# Altium schematic sheet hv_io_DCDC.SchDoc
size A4; Organization: Badgerloop; Address1: 133 Engineering Research; Address2: Building; Address3: Madison, WI 53715
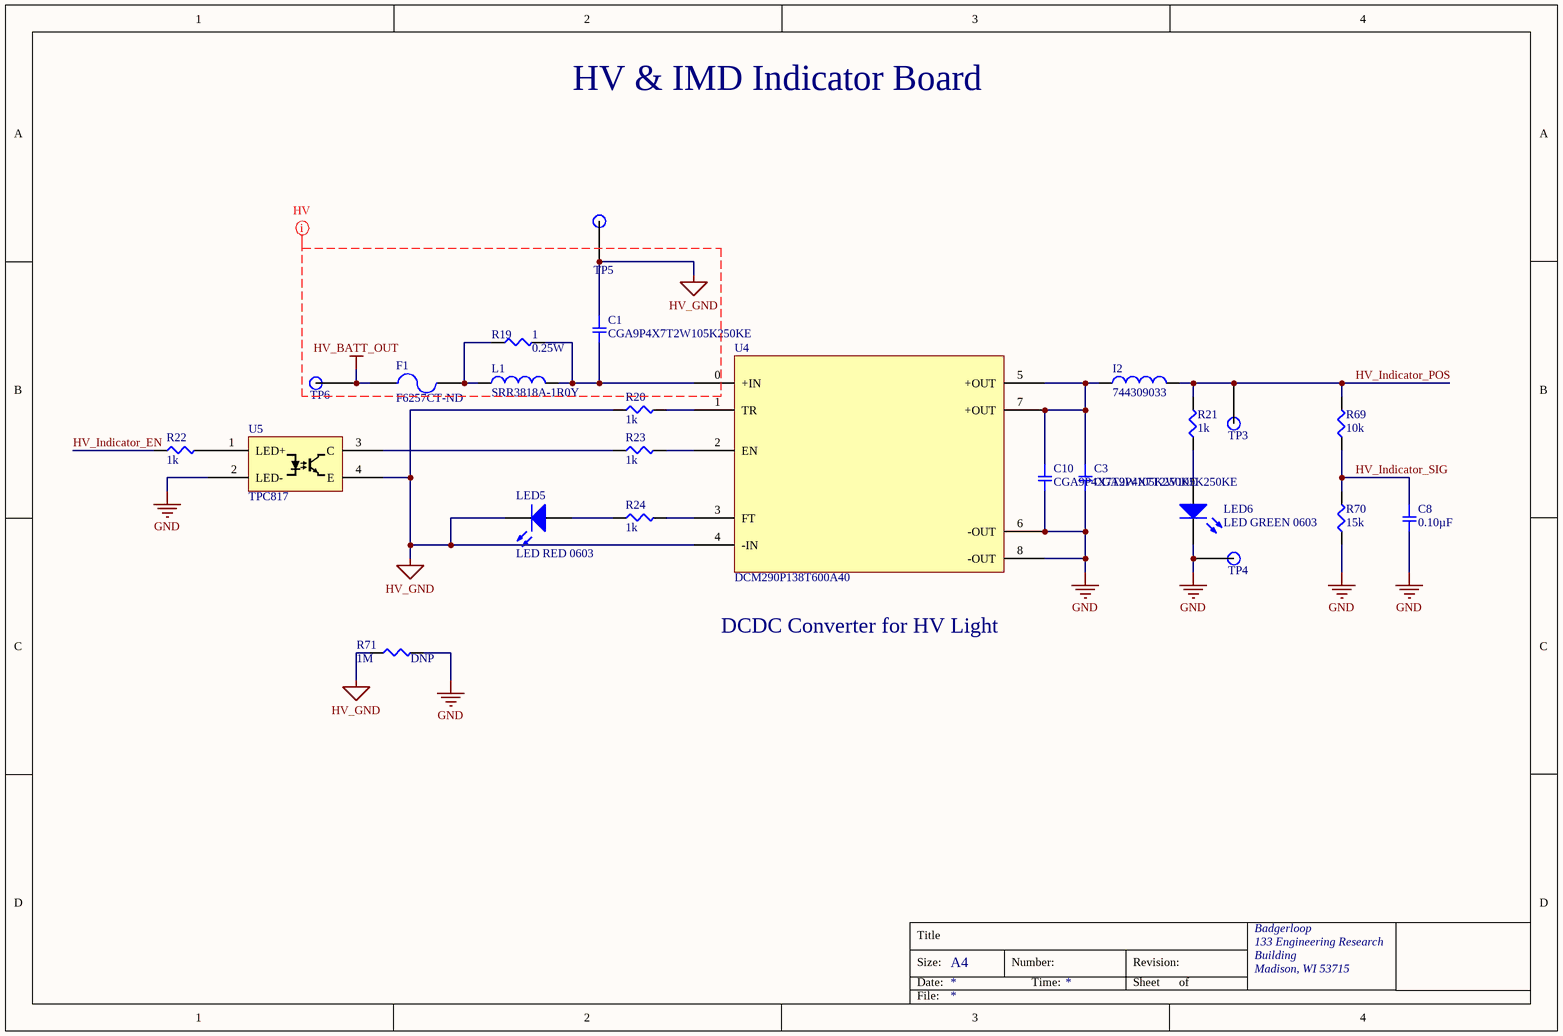
[diagram p0: hv_io_DCDC.SchDoc]

## Parts
C1  CGA9P4X7T2W105K250KE  [CAPC8350X15N]
C3  CGA9P4X7T2W105K250KE  [CAPC8350X15N]
C8  0.10µF  [SMD-0805C]
C10  CGA9P4X7T2W105K250KE  [CAPC8350X15N]
F1  F6257CT-ND  [SMD-0805-RES]
I2  744309033  [INDM140130X90N]
L1  SRR3818A-1R0Y  [INDM3838X18N]
LED5  LED RED 0603  [LED 0603 RED]
LED6  LED GREEN 0603  [LED 0603 GREEN]
R19  1  Power (Watts): 0.25W  [SMD-1206-RES]
R20  1k  [SMD-0805-RES]
R21  1k  [SMD-0805-RES]
R22  1k  [SMD-0805-RES]
R23  1k  [SMD-0805-RES]
R24  1k  [SMD-0805-RES]
R69  10k  [SMD-0805-RES]
R70  15k  [SMD-0805-RES]
R71  1M  [SMD-1206-RES]
TP3  TP  [Test Point]  (value not drawn)
TP4  TP  [Test Point]  (value not drawn)
TP5  TP  [Test Point]  (value not drawn)
TP6  TP  [Test Point]  (value not drawn)
U4  DCM290P138T600A40  [DCM290y138x600A40]
U5  TPC817  [SOT200P1005X328-5N]

## Nets
GND: C3.2 C8.2 C10.2 LED6.2(K) R70.1 R71.2 TP4.1 U4.6(-OUT) U4.8(-OUT) U5.2(LED-)
HV_BATT_OUT: F1.1 TP6.1
HV_GND: C1.1 LED5.2(K) R20.1 R71.1 TP5.1 U4.4(-IN) U5.4(E)
HV_Indicator_EN: R22.1
HV_Indicator_POS: I2.2 R21.2 R69.2 TP3.1
HV_Indicator_SIG: C8.1 R69.1 R70.2
NetC1_2: C1.2 L1.2 R19.2 U4.0(+IN)
NetC3_1: C3.1 C10.1 I2.1 U4.5(+OUT) U4.7(+OUT)
NetF1_2: F1.2 L1.1 R19.1
NetLED5_1: LED5.1(A) R24.1
NetLED6_1: LED6.1(A) R21.1
NetR20_2: R20.2 U4.1(TR)
NetR22_2: R22.2 U5.1(LED+)
NetR23_1: R23.1 U5.3(C)
NetR23_2: R23.2 U4.2(EN)
NetR24_2: R24.2 U4.3(FT)

## Layout directives
rule Clearance Constraint [Clearance = 100mil]: HV_BATT_OUT, HV_GND

## Notes on the sheet
- HV & IMD Indicator Board
- DCDC Converter for HV Light
- Title
- Size:
- Date:
- A4
- Number:
- Time:
- Revision:
- Sheet
- of
- File:

## Library data of the parts
C1 C3 C10 = CGA9P4X7T2W105K250KE: CAP CER 1UF 450V X7T 2220; Manufacturer: TDK; Digikey Link: https://www.digikey.com/product-detail/en/tdk-corporation/CGA9P4X7T2W105K250KE/445-8765-1-ND/3248632; Digikey P/N: 445-8765-1-ND; Manufacturer P/N: CGA9P4X7T2W105K250KE
C8 = GCD21BR71H104KA01L: CAP CER 0.1UF 50V X7R 0805; Manufacturer: Murata Electronics North America; Factory Stock: 0; Unit Price (USD): 0.24; Minimum Quantity: 1; Tolerance: ±10%; Datasheets: http://www.murata.com/~/media/webrenewal/support/library/catalog/products/capacitor/mlcc/c03e.ashx; Image: //media.digikey.com/Renders/Murata%20Renders/0805%28GxM6%29.jpg; Digikey P/N: 490-11955-1-ND; Part Number: GCD21BR71H104KA01L; Quantity Available: 157; @ qty: 0; Packaging: Cut Tape (CT); Series: GCD; Part Status: Active; Value: 0.10µF; Voltage: 50V; Temperature Coefficient: X7R; Operating Temperature: -55°C ~ 125°C; Features: -; Ratings: AEC-Q200; Applications: Automotive; Mounting Type: Surface Mount, MLCC; Package / Case: 0805 (2012 Metric); Size / Dimension: 0.079" L x 0.049" W (2.00mm x 1.25mm); Height - Seated (Max): -; Thickness (Max): 0.049" (1.25mm); Lead Spacing: -; Lead Style: -
F1 = F6257CT-ND: FUSE BOARD MNT 500MA 350VAC/VDC; Manufacturer: Littelfuse; Manufacturer P/N: 46205000000; Digikey P/N: F6257CT-ND; Digikey Link: https://www.digikey.com/product-detail/en/littelfuse-inc/46205000000/F6257CT-ND/4331764
I2 = 744309033: FIXED IND 330NH 47.5A 0.165 MOHM; Manufacturer: Wurth; Digikey Link: https://www.digikey.com/product-detail/en/wurth-electronics-inc/744309033/732-3006-1-ND/2626130; Digikey P/N: 732-3006-1-ND; Manufacturer P/N: 744309033
L1 = SRR3818A-1R0Y: FIXED IND 1UH 3.6A 37 MOHM SMD; Manufacturer: Bourns Inc.; Digikey Link: https://www.digikey.com/product-detail/en/bourns-inc/SRR3818A-1R0Y/SRR3818A-1R0YCT-ND/7556036; Digikey P/N: SRR3818A-1R0YCT-ND; Manufacturer P/N: SRR3818A-1R0Y
LED5 = LED RED 0603: Red 631nm LED Indication - Discrete 2V 0603 (1608 Metric); Manufacturer: Lite-On Inc.; Manufacturer P/N: LTST-C190KRKT; Digikey P/N: 160-1436-1-ND; Package / Case: 0603; Color: RED
LED6 = LED GREEN 0603: Manufacturer: Lite-On Inc.; Manufacturer P/N: LTST-C190KGKT; Digikey P/N: 160-1435-1-ND; Package / Case: 0603; Color: GREEN
R19 = ERJ-8RQF1R0V: RES SMD 1 OHM 1% 1/4W 1206; Manufacturer: Panasonic Electronic Components; Factory Stock: 0; Unit Price (USD): 0.07650; @ qty: 1500; Temperature Coefficient: ±200ppm/°C; Part Number: ERJ-8RQF1R0V; Datasheets: https://industrial.panasonic.com/cdbs/www-data/pdf/RDA0000/AOA0000C239.pdf; Image: //media.digikey.com/Renders/Panasonic%20Renders/ERJ-1206%20Pkg.jpg; Digi-Key Part Number: P1.0RCT-ND; Quantity Available: 73166; Minimum Quantity: 1; Packaging: Cut Tape (CT); Series: ERJ; Part Status: Active; Value: 1; Tolerance: ±1%; Composition: Thick Film; Features: Automotive AEC-Q200, Current Sense; Operating Temperature: -55°C ~ 125°C; Package / Case: 1206 (3216 Metric); Supplier Device Package: 1206; Size / Dimension: 0.126" L x 0.063" W (3.20mm x 1.60mm); Height - Seated (Max): 0.028" (0.70mm); Number of Terminations: 2; Failure Rate: -; Digikey P/N: ERJ-8RQF1R0V
R20-R24 = ERJ-6ENF1001V: RES SMD 1K OHM 1% 1/8W 0805; Manufacturer: Panasonic Electronic Components; Factory Stock: 0; Unit Price (USD): 0.00729; @ qty: 1500; Minimum Quantity: 1; Power (Watts): 0.125W, 1/8W; Temperature Coefficient: ±100ppm/°C; Part Number: ERJ-6ENF1001V; Datasheets: http://industrial.panasonic.com/www-cgi/jvcr13pz.cgi?E+PZ+3+AOA0002+ERJ6ENF1001V+7+WW; Image: //media.digikey.com/Renders/Panasonic%20Renders/ERJ-0805%20Pkg.jpg; Digi-Key Part Number: P1.00KCCT-ND; Quantity Available: 12895103; Packaging: Cut Tape (CT); Series: ERJ; Part Status: Active; Value: 1k; Tolerance: ±1%; Composition: Thick Film; Features: Automotive AEC-Q200; Operating Temperature: -55°C ~ 155°C; Package / Case: 0805 (2012 Metric); Supplier Device Package: 0805; Size / Dimension: 0.079" L x 0.049" W (2.00mm x 1.25mm); Height - Seated (Max): 0.028" (0.70mm); Number of Terminations: 2; Failure Rate: -; Digikey P/N: ERJ-6ENF1001V
R69 = ERJ-P06J103V: RES SMD 10K OHM 5% 1/2W 0805; Manufacturer: Panasonic Electronic Components; Factory Stock: 0; Unit Price (USD): 0.01839; @ qty: 1500; Minimum Quantity: 1; Power (Watts): 0.5W, 1/2W; Temperature Coefficient: ±200ppm/°C; Part Number: ERJ-P06J103V; Datasheets: https://industrial.panasonic.com/cdbs/www-data/pdf/RDA0000/AOA0000C243.pdf; Image: //media.digikey.com/Renders/Panasonic%20Renders/ERJ-0805%20Pkg.jpg; Digi-Key Part Number: P10KADCT-ND; Quantity Available: 413576; Packaging: Cut Tape (CT); Series: ERJ; Part Status: Active; Value: 10k; Tolerance: ±5%; Composition: Thick Film; Features: Automotive AEC-Q200, Pulse Withstanding; Operating Temperature: -55°C ~ 155°C; Package / Case: 0805 (2012 Metric); Supplier Device Package: 0805; Size / Dimension: 0.079" L x 0.049" W (2.00mm x 1.25mm); Height - Seated (Max): 0.028" (0.70mm); Number of Terminations: 2; Failure Rate: -; Digikey P/N: ERJ-P06J103V
R70 = ERJ-P06J153V: RES SMD 15K OHM 5% 1/2W 0805; Manufacturer: Panasonic Electronic Components; Factory Stock: 0; Unit Price (USD): 0.01839; @ qty: 1500; Minimum Quantity: 1; Power (Watts): 0.5W, 1/2W; Temperature Coefficient: ±200ppm/°C; Part Number: ERJ-P06J153V; Datasheets: https://industrial.panasonic.com/cdbs/www-data/pdf/RDA0000/AOA0000C243.pdf; Image: //media.digikey.com/Renders/Panasonic%20Renders/ERJ-0805%20Pkg.jpg; Digi-Key Part Number: P15KADCT-ND; Quantity Available: 18476; Packaging: Cut Tape (CT); Series: ERJ; Part Status: Active; Value: 15k; Tolerance: ±5%; Composition: Thick Film; Features: Automotive AEC-Q200, Pulse Withstanding; Operating Temperature: -55°C ~ 155°C; Package / Case: 0805 (2012 Metric); Supplier Device Package: 0805; Size / Dimension: 0.079" L x 0.049" W (2.00mm x 1.25mm); Height - Seated (Max): 0.028" (0.70mm); Number of Terminations: 2; Failure Rate: -; Digikey P/N: ERJ-P06J153V
R71 = ERJ-P08J105V: RES SMD 1M OHM 5% 2/3W 1206; Manufacturer: Panasonic Electronic Components; Factory Stock: 0; Unit Price (USD): 0.02178; @ qty: 1500; Minimum Quantity: 1; Power (Watts): 0.667W, 2/3W; Temperature Coefficient: ±200ppm/°C; Part Number: ERJ-P08J105V; Datasheets: https://industrial.panasonic.com/cdbs/www-data/pdf/RDA0000/AOA0000C243.pdf; Image: //media.digikey.com/Renders/Panasonic%20Renders/ERJ-1206%20Pkg.jpg; Digi-Key Part Number: P1.0MALCT-ND; Quantity Available: 10388; Packaging: Cut Tape (CT); Series: ERJ; Part Status: Active; Value: 1M; Tolerance: ±5%; Composition: Thick Film; Features: Automotive AEC-Q200, Pulse Withstanding; Operating Temperature: -55°C ~ 155°C; Package / Case: 1206 (3216 Metric); Supplier Device Package: 1206; Size / Dimension: 0.126" L x 0.063" W (3.20mm x 1.60mm); Height - Seated (Max): 0.028" (0.70mm); Number of Terminations: 2; Failure Rate: -; Digikey P/N: ERJ-P08J105V; DNP: DNP
U4 = DCM290P138T600A40: DC DC CONVERTER 13.8V 600W; Manufacturer: Vicor; Manufacturer P/N: DCM290P138T600A40; Digikey Link: https://www.digikey.com/product-detail/en/vicor-corporation/DCM290P138T600A40/1102-5388-ND/4860626; Digikey P/N: 1102-5388-ND
U5 = TPC817: OPTOISO 5KV TRANS 4SOP; Manufacturer: Taiwan Semi; Manufacturer P/N: TPC817S1B RAG; Digikey Link: https://www.digikey.com/product-detail/en/taiwan-semiconductor-corporation/TPC817S1B-RAG/TPC817S1BRAGCT-ND/7359679; Digikey P/N: TPC817S1BRAGCT-ND